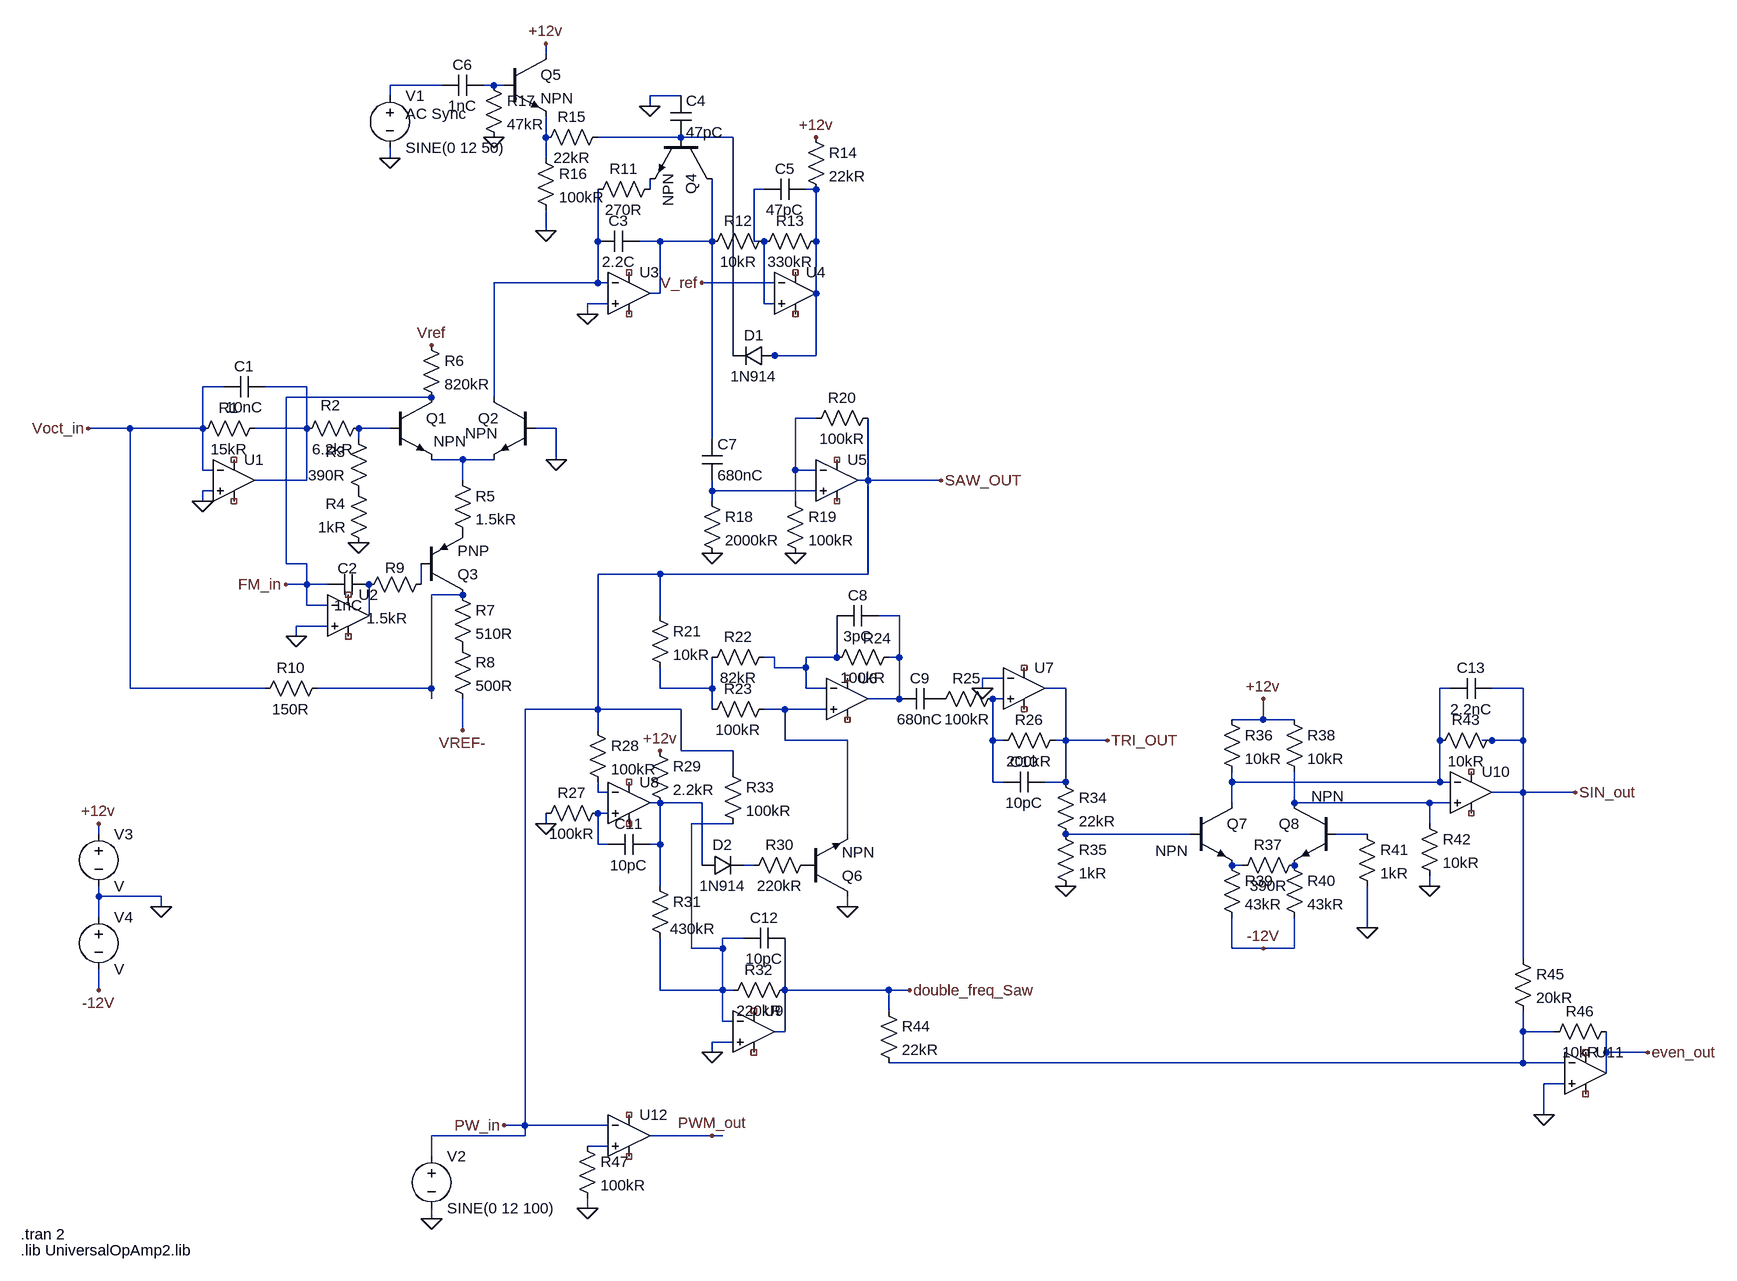
[diagram p0: schematic evenVCO.asc]
evenVCO.asc, the LTspice schematic file:
Version 4
SHEET 1 2464 1296
WIRE 640 -560 640 -576
WIRE 480 -512 400 -512
WIRE 560 -512 544 -512
WIRE 576 -512 560 -512
WIRE 400 -496 400 -512
WIRE 848 -496 800 -496
WIRE 800 -480 800 -496
WIRE 640 -432 640 -464
WIRE 848 -432 720 -432
WIRE 928 -432 848 -432
WIRE 400 -400 400 -416
WIRE 640 -400 640 -432
WIRE 800 -352 800 -368
WIRE 976 -352 960 -352
WIRE 1056 -352 1040 -352
WIRE 640 -288 640 -320
WIRE 720 -272 720 -352
WIRE 816 -272 784 -272
WIRE 896 -272 896 -368
WIRE 896 -272 816 -272
WIRE 960 -272 960 -352
WIRE 976 -272 960 -272
WIRE 1056 -272 1056 -352
WIRE 720 -208 720 -272
WIRE 720 -208 560 -208
WIRE 736 -208 720 -208
WIRE 992 -208 880 -208
WIRE 816 -192 816 -272
WIRE 816 -192 800 -192
WIRE 1056 -192 1056 -272
WIRE 736 -176 704 -176
WIRE 976 -176 976 -272
WIRE 992 -176 976 -176
WIRE 704 -160 704 -176
WIRE 928 -96 928 -432
WIRE 992 -96 976 -96
WIRE 1056 -96 1056 -192
WIRE 1056 -96 992 -96
WIRE 144 -48 112 -48
WIRE 272 -48 208 -48
WIRE 464 -32 240 -32
WIRE 560 -32 560 -208
WIRE 1056 0 1024 0
WIRE 0 16 -64 16
WIRE 112 16 112 -48
WIRE 112 16 0 16
WIRE 272 16 272 -48
WIRE 272 16 192 16
WIRE 400 16 352 16
WIRE 656 16 624 16
WIRE 352 32 352 16
WIRE 896 32 896 -272
WIRE 512 64 464 64
WIRE 560 64 512 64
WIRE 656 64 656 16
WIRE 112 80 112 16
WIRE 128 80 112 80
WIRE 1024 80 1024 0
WIRE 1056 80 1024 80
WIRE 272 96 272 16
WIRE 272 96 192 96
WIRE 512 96 512 64
WIRE 1136 96 1136 0
WIRE 1136 96 1120 96
WIRE 1248 96 1136 96
WIRE 128 112 112 112
WIRE 896 112 896 96
WIRE 1056 112 896 112
WIRE 112 128 112 112
WIRE 896 128 896 112
WIRE 1024 128 1024 80
WIRE 240 224 240 -32
WIRE 272 224 240 224
WIRE 816 240 720 240
WIRE 1136 240 1136 96
WIRE 1136 240 816 240
WIRE 272 256 272 224
WIRE 272 256 240 256
WIRE 304 256 272 256
WIRE 448 256 448 224
WIRE 512 272 464 272
WIRE 272 288 272 256
WIRE 304 288 272 288
WIRE 368 304 368 256
WIRE 816 304 816 240
WIRE 1184 304 1152 304
WIRE 304 320 256 320
WIRE 256 336 256 320
WIRE 992 368 976 368
WIRE 1088 368 1088 304
WIRE 1088 368 1040 368
WIRE 1184 368 1184 304
WIRE 1184 368 1168 368
WIRE 992 384 992 368
WIRE 1040 384 1040 368
WIRE 1040 384 992 384
WIRE 1344 400 1312 400
WIRE 0 416 0 16
WIRE 208 416 0 416
WIRE 464 416 464 272
WIRE 464 416 288 416
WIRE 816 416 816 384
WIRE 896 416 896 368
WIRE 896 416 816 416
WIRE 1040 416 1040 384
WIRE 1072 416 1040 416
WIRE 1312 416 1312 400
WIRE 1440 416 1408 416
WIRE 2032 416 2016 416
WIRE 2144 416 2096 416
WIRE 464 432 464 416
WIRE 1184 432 1184 368
WIRE 1184 432 1136 432
WIRE 1344 432 1328 432
WIRE 720 448 720 240
WIRE 720 448 608 448
WIRE 848 448 720 448
WIRE 896 448 896 416
WIRE 1008 448 976 448
WIRE 1072 448 1008 448
WIRE 1744 464 1744 432
WIRE 1744 464 1696 464
WIRE 1792 464 1744 464
WIRE 512 480 512 432
WIRE 720 480 720 448
WIRE 1008 496 1008 448
WIRE 1104 496 1008 496
WIRE 1328 496 1328 432
WIRE 1344 496 1328 496
WIRE 1440 496 1440 416
WIRE 1440 496 1424 496
WIRE 1504 496 1440 496
WIRE 2016 496 2016 416
WIRE 2096 496 2080 496
WIRE 2144 496 2144 416
WIRE 2144 496 2096 496
WIRE 848 512 848 448
WIRE 928 512 848 512
WIRE 928 544 928 512
WIRE 1328 560 1328 496
WIRE 1344 560 1328 560
WIRE 1440 560 1440 496
WIRE 1440 560 1408 560
WIRE 1696 560 1696 544
WIRE 2016 560 2016 496
WIRE 2016 560 1696 560
WIRE 2032 560 2016 560
WIRE 720 576 720 560
WIRE 736 576 720 576
WIRE 2144 576 2144 496
WIRE 2144 576 2096 576
WIRE 2224 576 2144 576
WIRE 816 592 800 592
WIRE 880 592 816 592
WIRE 1696 592 1696 560
WIRE 1792 592 1792 544
WIRE 2000 592 1792 592
WIRE 2032 592 2000 592
WIRE 736 608 720 608
WIRE 640 624 640 608
WIRE 928 624 864 624
WIRE 2000 624 2000 592
WIRE -48 640 -48 624
WIRE 1104 640 1104 496
WIRE 1632 640 1440 640
WIRE 1904 640 1856 640
WIRE 720 656 720 608
WIRE 736 656 720 656
WIRE 816 656 816 592
WIRE 816 656 800 656
WIRE 880 688 880 592
WIRE 960 688 944 688
WIRE 1712 688 1696 688
WIRE 816 720 816 656
WIRE 2000 720 2000 704
WIRE -48 736 -48 720
WIRE 48 736 -48 736
WIRE 48 752 48 736
WIRE 1104 752 1104 736
WIRE -48 768 -48 736
WIRE 1904 784 1904 720
WIRE 944 800 912 800
WIRE 864 816 864 624
WIRE 912 816 912 800
WIRE 912 816 864 816
WIRE 1696 816 1696 768
WIRE 1744 816 1696 816
WIRE 1792 816 1792 768
WIRE 1792 816 1744 816
WIRE 2144 832 2144 576
WIRE -48 880 -48 848
WIRE 816 880 816 800
WIRE 912 880 912 816
WIRE 912 880 816 880
WIRE 928 880 912 880
WIRE 1008 880 1008 800
WIRE 1168 880 1008 880
WIRE 1200 880 1168 880
WIRE 1168 912 1168 880
WIRE 912 928 912 880
WIRE 928 928 912 928
WIRE 1008 944 1008 880
WIRE 1008 944 992 944
WIRE 2144 944 2144 912
WIRE 2192 944 2144 944
WIRE 928 960 896 960
WIRE 896 976 896 960
WIRE 2272 976 2272 944
WIRE 2336 976 2272 976
WIRE 2144 992 2144 944
WIRE 2144 992 1168 992
WIRE 2208 992 2144 992
WIRE 2272 1008 2272 976
WIRE 2208 1024 2176 1024
WIRE 2176 1072 2176 1024
WIRE 608 1088 608 448
WIRE 608 1088 576 1088
WIRE 736 1088 608 1088
WIRE 608 1104 608 1088
WIRE 608 1104 464 1104
WIRE 896 1104 800 1104
WIRE 912 1104 896 1104
WIRE 736 1120 704 1120
WIRE 464 1136 464 1104
WIRE 704 1216 704 1200
WIRE 464 1232 464 1216
FLAG 112 128 0
FLAG 352 192 0
FLAG 656 64 0
FLAG 512 480 VREF-
FLAG 256 336 0
FLAG 240 256 FM_in
FLAG 464 -112 Vref
FLAG -64 16 Voct_in
FLAG 704 -160 0
FLAG 800 -480 0
FLAG 1056 -432 +12v
FLAG 880 -208 V_ref
FLAG 640 -288 0
FLAG 640 -576 +12v
FLAG 560 -432 0
FLAG 400 -400 0
FLAG 896 208 0
FLAG 1024 208 0
FLAG 1248 96 SAW_OUT
FLAG 1312 416 0
FLAG 1504 496 TRI_OUT
FLAG 640 624 0
FLAG 816 512 +12v
FLAG 1104 752 0
FLAG 896 976 0
FLAG 1200 880 double_freq_Saw
FLAG 1440 720 0
FLAG 1904 784 0
FLAG 1744 432 +12v
FLAG 1744 816 -12V
FLAG 2000 720 0
FLAG 2224 576 SIN_out
FLAG 2176 1072 0
FLAG 2336 976 even_out
FLAG 704 1216 0
FLAG 896 1104 PWM_out
FLAG 576 1088 PW_in
FLAG 464 1232 0
FLAG 48 752 0
FLAG -48 624 +12v
FLAG -48 880 -12V
SYMBOL res 208 0 R90
WINDOW 0 0 56 VBottom 2
WINDOW 3 32 56 VTop 2
SYMATTR InstName R1
SYMATTR Value 15kR
SYMBOL cap 208 -64 R90
WINDOW 0 0 32 VBottom 2
WINDOW 3 32 32 VTop 2
SYMATTR InstName C1
SYMATTR Value 10nC
SYMBOL res 368 0 R90
WINDOW 0 -4 59 VBottom 2
WINDOW 3 32 56 VTop 2
SYMATTR InstName R2
SYMATTR Value 6.2kR
SYMBOL res 368 128 R180
WINDOW 0 36 76 Left 2
WINDOW 3 36 40 Left 2
SYMATTR InstName R3
SYMATTR Value 390R
SYMBOL res 368 208 R180
WINDOW 0 36 76 Left 2
WINDOW 3 36 40 Left 2
SYMATTR InstName R4
SYMATTR Value 1kR
SYMBOL npn 400 -32 R0
WINDOW 3 67 68 Left 2
SYMATTR InstName Q1
SYMBOL npn 624 -32 M0
WINDOW 3 58 55 Left 2
SYMATTR InstName Q2
SYMBOL res 496 80 R0
SYMATTR InstName R5
SYMATTR Value 1.5kR
SYMBOL res 448 -128 R0
SYMATTR InstName R6
SYMATTR Value 820kR
SYMBOL pnp 448 272 M180
SYMATTR InstName Q3
SYMBOL res 496 256 R0
SYMATTR InstName R7
SYMATTR Value 510R
SYMBOL res 496 336 R0
SYMATTR InstName R8
SYMATTR Value 500R
SYMBOL res 464 240 R90
WINDOW 0 6 56 VBottom 2
WINDOW 3 52 68 VTop 2
SYMATTR InstName R9
SYMATTR Value 1.5kR
SYMBOL cap 368 240 R90
WINDOW 0 7 33 VBottom 2
WINDOW 3 32 32 VTop 2
SYMATTR InstName C2
SYMATTR Value 1nC
SYMBOL res 304 400 R90
WINDOW 0 0 56 VBottom 2
WINDOW 3 32 56 VTop 2
SYMATTR InstName R10
SYMATTR Value 150R
SYMBOL cap 784 -288 R90
WINDOW 0 0 32 VBottom 2
WINDOW 3 32 32 VTop 2
SYMATTR InstName C3
SYMATTR Value 2.2C
SYMBOL res 816 -368 R90
WINDOW 0 0 56 VBottom 2
WINDOW 3 32 56 VTop 2
SYMATTR InstName R11
SYMATTR Value 270R
SYMBOL npn 896 -432 R90
SYMATTR InstName Q4
SYMBOL cap 832 -496 R0
SYMATTR InstName C4
SYMATTR Value 47pC
SYMBOL res 992 -288 R90
WINDOW 0 0 56 VBottom 2
WINDOW 3 32 56 VTop 2
SYMATTR InstName R12
SYMATTR Value 10kR
SYMBOL res 1072 -288 R90
WINDOW 0 0 56 VBottom 2
WINDOW 3 32 56 VTop 2
SYMATTR InstName R13
SYMATTR Value 330kR
SYMBOL cap 1040 -368 R90
WINDOW 0 0 32 VBottom 2
WINDOW 3 32 32 VTop 2
SYMATTR InstName C5
SYMATTR Value 47pC
SYMBOL res 1040 -448 R0
SYMATTR InstName R14
SYMATTR Value 22kR
SYMBOL diode 992 -112 R90
WINDOW 0 0 32 VBottom 2
WINDOW 3 32 32 VTop 2
SYMATTR InstName D1
SYMATTR Value 1N914
SYMBOL res 736 -448 R90
WINDOW 0 0 56 VBottom 2
WINDOW 3 32 56 VTop 2
SYMATTR InstName R15
SYMATTR Value 22kR
SYMBOL res 624 -416 R0
SYMATTR InstName R16
SYMATTR Value 100kR
SYMBOL npn 576 -560 R0
SYMATTR InstName Q5
SYMBOL res 544 -528 R0
SYMATTR InstName R17
SYMATTR Value 47kR
SYMBOL cap 544 -528 R90
WINDOW 0 0 32 VBottom 2
WINDOW 3 32 32 VTop 2
SYMATTR InstName C6
SYMATTR Value 1nC
SYMBOL voltage 400 -512 R0
WINDOW 123 24 44 Left 2
WINDOW 39 0 0 Left 0
SYMATTR Value2 AC Sync
SYMATTR InstName V1
SYMATTR Value SINE(0 12 50)
SYMBOL cap 880 32 R0
SYMATTR InstName C7
SYMATTR Value 680nC
SYMBOL res 880 112 R0
SYMATTR InstName R18
SYMATTR Value 2000kR
SYMBOL res 1008 112 R0
SYMATTR InstName R19
SYMATTR Value 100kR
SYMBOL res 1152 -16 R90
WINDOW 0 0 56 VBottom 2
WINDOW 3 32 56 VTop 2
SYMATTR InstName R20
SYMATTR Value 100kR
SYMBOL res 800 288 R0
SYMATTR InstName R21
SYMATTR Value 10kR
SYMBOL res 992 352 R90
WINDOW 0 0 56 VBottom 2
WINDOW 3 32 56 VTop 2
SYMATTR InstName R22
SYMATTR Value 82kR
SYMBOL res 992 432 R90
WINDOW 0 0 56 VBottom 2
WINDOW 3 32 56 VTop 2
SYMATTR InstName R23
SYMATTR Value 100kR
SYMBOL res 1184 352 R90
WINDOW 0 2 34 VBottom 2
WINDOW 3 32 56 VTop 2
SYMATTR InstName R24
SYMATTR Value 100kR
SYMBOL cap 1152 288 R90
WINDOW 0 0 32 VBottom 2
WINDOW 3 32 32 VTop 2
SYMATTR InstName C8
SYMATTR Value 3pC
SYMBOL cap 1248 416 R90
WINDOW 0 0 32 VBottom 2
WINDOW 3 32 32 VTop 2
SYMATTR InstName C9
SYMATTR Value 680nC
SYMBOL res 1344 416 R90
WINDOW 0 0 56 VBottom 2
WINDOW 3 32 56 VTop 2
SYMATTR InstName R25
SYMATTR Value 100kR
SYMBOL res 1440 480 R90
WINDOW 0 0 56 VBottom 2
WINDOW 3 32 56 VTop 2
SYMATTR InstName R26
SYMATTR Value 200kR
SYMBOL cap 1408 544 R90
WINDOW 0 0 32 VBottom 2
WINDOW 3 32 32 VTop 2
SYMATTR InstName C10
SYMATTR Value 10pC
SYMBOL res 736 592 R90
WINDOW 0 0 56 VBottom 2
WINDOW 3 32 56 VTop 2
SYMATTR InstName R27
SYMATTR Value 100kR
SYMBOL cap 800 640 R90
WINDOW 0 0 32 VBottom 2
WINDOW 3 32 32 VTop 2
SYMATTR InstName C11
SYMATTR Value 10pC
SYMBOL res 704 464 R0
SYMATTR InstName R28
SYMATTR Value 100kR
SYMBOL res 800 496 R0
SYMATTR InstName R29
SYMATTR Value 2.2kR
SYMBOL npn 1040 736 M180
SYMATTR InstName Q6
SYMBOL res 1056 672 R90
WINDOW 0 0 56 VBottom 2
WINDOW 3 32 56 VTop 2
SYMATTR InstName R30
SYMATTR Value 220kR
SYMBOL diode 880 704 R270
WINDOW 0 32 32 VTop 2
WINDOW 3 0 32 VBottom 2
SYMATTR InstName D2
SYMATTR Value 1N914
SYMBOL res 800 704 R0
WINDOW 3 31 82 Left 2
SYMATTR Value 430kR
SYMATTR InstName R31
SYMBOL res 1024 864 R90
WINDOW 0 0 56 VBottom 2
WINDOW 3 32 56 VTop 2
SYMATTR InstName R32
SYMATTR Value 220kR
SYMBOL cap 1008 784 R90
WINDOW 0 0 32 VBottom 2
WINDOW 3 32 32 VTop 2
SYMATTR InstName C12
SYMATTR Value 10pC
SYMBOL res 912 528 R0
SYMATTR InstName R33
SYMATTR Value 100kR
SYMBOL res 1424 544 R0
SYMATTR InstName R34
SYMATTR Value 22kR
SYMBOL res 1424 624 R0
SYMATTR InstName R35
SYMATTR Value 1kR
SYMBOL npn 1632 592 R0
WINDOW 3 -54 74 Left 2
SYMATTR InstName Q7
SYMBOL npn 1856 592 M0
WINDOW 3 -12 -10 Left 2
SYMATTR InstName Q8
SYMBOL res 1680 448 R0
SYMATTR InstName R36
SYMATTR Value 10kR
SYMBOL res 1808 672 R90
WINDOW 0 0 56 VBottom 2
WINDOW 3 32 56 VTop 2
SYMATTR InstName R37
SYMATTR Value 390R
SYMBOL res 1776 448 R0
SYMATTR InstName R38
SYMATTR Value 10kR
SYMBOL res 1680 672 R0
SYMATTR InstName R39
SYMATTR Value 43kR
SYMBOL res 1776 672 R0
SYMATTR InstName R40
SYMATTR Value 43kR
SYMBOL res 1888 624 R0
SYMATTR InstName R41
SYMATTR Value 1kR
SYMBOL res 1984 608 R0
SYMATTR InstName R42
SYMATTR Value 10kR
SYMBOL res 2112 480 R90
WINDOW 0 0 56 VBottom 2
WINDOW 3 32 56 VTop 2
SYMATTR InstName R43
SYMATTR Value 10kR
SYMBOL cap 2096 400 R90
WINDOW 0 0 32 VBottom 2
WINDOW 3 32 32 VTop 2
SYMATTR InstName C13
SYMATTR Value 2.2nC
SYMBOL res 1152 896 R0
SYMATTR InstName R44
SYMATTR Value 22kR
SYMBOL res 2128 816 R0
SYMATTR InstName R45
SYMATTR Value 20kR
SYMBOL res 2288 928 R90
WINDOW 0 0 56 VBottom 2
WINDOW 3 32 56 VTop 2
SYMATTR InstName R46
SYMATTR Value 10kR
SYMBOL res 688 1104 R0
SYMATTR InstName R47
SYMATTR Value 100kR
SYMBOL voltage 464 1120 R0
WINDOW 123 0 0 Left 0
WINDOW 39 0 0 Left 0
SYMATTR InstName V2
SYMATTR Value SINE(0 12 100)
SYMBOL voltage -48 624 R0
SYMATTR InstName V3
SYMBOL voltage -48 752 R0
SYMATTR InstName V4
SYMBOL OpAmps\\UniversalOpAmp2 160 96 R0
SYMATTR InstName U1
SYMBOL OpAmps\\UniversalOpAmp2 768 -192 R0
SYMATTR InstName U3
SYMBOL OpAmps\\UniversalOpAmp2 1024 -192 R0
SYMATTR InstName U4
SYMBOL OpAmps\\UniversalOpAmp2 1088 96 R0
SYMATTR InstName U5
SYMBOL OpAmps\\UniversalOpAmp2 1104 432 R0
SYMATTR InstName U6
SYMBOL OpAmps\\UniversalOpAmp2 1376 416 R0
SYMATTR InstName U7
SYMBOL OpAmps\\UniversalOpAmp2 336 304 R0
SYMATTR InstName U2
SYMBOL OpAmps\\UniversalOpAmp2 768 592 R0
SYMATTR InstName U8
SYMBOL OpAmps\\UniversalOpAmp2 960 944 R0
SYMATTR InstName U9
SYMBOL OpAmps\\UniversalOpAmp2 2064 576 R0
SYMATTR InstName U10
SYMBOL OpAmps\\UniversalOpAmp2 2240 1008 R0
SYMATTR InstName U11
SYMBOL OpAmps\\UniversalOpAmp2 768 1104 R0
SYMATTR InstName U12
TEXT -168 1256 Left 2 !.tran 2
TEXT -168 1280 Left 2 !.lib UniversalOpAmp2.lib

The netlist it stands for:
* evenVCO.asc
R1 N010 Voct_in 15kR
C1 N010 Voct_in 10nC
R2 N012 N010 6.2kR
R3 P001 N012 390R
R4 0 P001 1kR
Q1 FM_in N012 N013 0 NPN
Q2 N008 0 N013 0 NPN
R5 N013 P002 1.5kR
R6 Vref FM_in 820kR
Q3 N016 N015 P002 0 PNP
R7 N016 P003 510R
R8 P003 VREF- 500R
R9 N015 N017 1.5kR
C2 N017 FM_in 1nC
R10 N016 Voct_in 150R
C3 N009 N008 2.2C
R11 N005 N008 270R
Q4 N009 N004 N005 0 NPN
C4 0 N004 47pC
R12 N006 N009 10kR
R13 N007 N006 330kR
C5 N007 N006 47pC
R14 +12v N007 22kR
D1 N007 N004 1N914
R15 N004 N003 22kR
R16 N003 0 100kR
Q5 +12v N002 N003 0 NPN
R17 N002 0 47kR
C6 N002 N001 1nC
V1 N001 0 SINE(0 12 50) AC Sync
C7 N009 N014 680nC
R18 N014 0 2000kR
R19 N011 0 100kR
R20 PW_in N011 100kR
R21 PW_in N020 10kR
R22 N019 N020 82kR
R23 N023 N020 100kR
R24 N018 N019 100kR
C8 N018 N019 3pC
C9 P004 N018 680nC
R25 N022 P004 100kR
R26 TRI_OUT N022 200kR
C10 TRI_OUT N022 10pC
R27 N027 0 100kR
C11 N025 N027 10pC
R28 PW_in N024 100kR
R29 +12v N025 2.2kR
Q6 0 P005 N023 0 NPN
R30 P005 N031 220kR
D2 N025 N031 1N914
R31 N025 N028 430kR
R32 double_freq_Saw N028 220kR
C12 double_freq_Saw N028 10pC
R33 PW_in N028 100kR
R34 TRI_OUT N029 22kR
R35 N029 0 1kR
Q7 N021 N029 N032 0 NPN
Q8 N026 N030 P006 0 NPN
R36 +12v N021 10kR
R37 P006 N032 390R
R38 +12v N026 10kR
R39 N032 -12V 43kR
R40 P006 -12V 43kR
R41 N030 0 1kR
R42 N026 0 10kR
R43 SIN_out N021 10kR
C13 SIN_out N021 2.2nC
R44 double_freq_Saw N033 22kR
R45 SIN_out N033 20kR
R46 even_out N033 10kR
R47 N034 0 100kR
V2 PW_in 0 SINE(0 12 100)
V3 +12v 0 V
V4 0 -12V V
XU1 0 Voct_in NC_01 NC_02 N010 level2 Avol=1Meg GBW=10Meg Slew=10Meg Ilimit=25m Rail=0 Vos=0 En=0 Enk=0 In=0 Ink=0 Rin=500Meg  ; pins In+ In- V+ V- OUT
XU3 0 N008 NC_03 NC_04 N009 level2 Avol=1Meg GBW=10Meg Slew=10Meg Ilimit=25m Rail=0 Vos=0 En=0 Enk=0 In=0 Ink=0 Rin=500Meg  ; pins In+ In- V+ V- OUT
XU4 N006 V_ref NC_05 NC_06 N007 level2 Avol=1Meg GBW=10Meg Slew=10Meg Ilimit=25m Rail=0 Vos=0 En=0 Enk=0 In=0 Ink=0 Rin=500Meg  ; pins In+ In- V+ V- OUT
XU5 N014 N011 NC_07 NC_08 PW_in level2 Avol=1Meg GBW=10Meg Slew=10Meg Ilimit=25m Rail=0 Vos=0 En=0 Enk=0 In=0 Ink=0 Rin=500Meg  ; pins In+ In- V+ V- OUT
XU6 N023 N019 NC_09 NC_10 N018 level2 Avol=1Meg GBW=10Meg Slew=10Meg Ilimit=25m Rail=0 Vos=0 En=0 Enk=0 In=0 Ink=0 Rin=500Meg  ; pins In+ In- V+ V- OUT
XU7 N022 0 NC_11 NC_12 TRI_OUT level2 Avol=1Meg GBW=10Meg Slew=10Meg Ilimit=25m Rail=0 Vos=0 En=0 Enk=0 In=0 Ink=0 Rin=500Meg  ; pins In+ In- V+ V- OUT
XU2 0 FM_in NC_13 NC_14 N017 level2 Avol=1Meg GBW=10Meg Slew=10Meg Ilimit=25m Rail=0 Vos=0 En=0 Enk=0 In=0 Ink=0 Rin=500Meg  ; pins In+ In- V+ V- OUT
XU8 N027 N024 NC_15 NC_16 N025 level2 Avol=1Meg GBW=10Meg Slew=10Meg Ilimit=25m Rail=0 Vos=0 En=0 Enk=0 In=0 Ink=0 Rin=500Meg  ; pins In+ In- V+ V- OUT
XU9 0 N028 NC_17 NC_18 double_freq_Saw level2 Avol=1Meg GBW=10Meg Slew=10Meg Ilimit=25m Rail=0 Vos=0 En=0 Enk=0 In=0 Ink=0 Rin=500Meg  ; pins In+ In- V+ V- OUT
XU10 N026 N021 NC_19 NC_20 SIN_out level2 Avol=1Meg GBW=10Meg Slew=10Meg Ilimit=25m Rail=0 Vos=0 En=0 Enk=0 In=0 Ink=0 Rin=500Meg  ; pins In+ In- V+ V- OUT
XU11 0 N033 NC_21 NC_22 even_out level2 Avol=1Meg GBW=10Meg Slew=10Meg Ilimit=25m Rail=0 Vos=0 En=0 Enk=0 In=0 Ink=0 Rin=500Meg  ; pins In+ In- V+ V- OUT
XU12 N034 PW_in NC_23 NC_24 PWM_out level2 Avol=1Meg GBW=10Meg Slew=10Meg Ilimit=25m Rail=0 Vos=0 En=0 Enk=0 In=0 Ink=0 Rin=500Meg  ; pins In+ In- V+ V- OUT
.model D D
.lib standard.dio
.model NPN NPN
.model PNP PNP
.lib standard.bjt
.tran 2
.lib UniversalOpAmp2.lib
.lib UniversalOpAmp2.lib
.backanno
.end